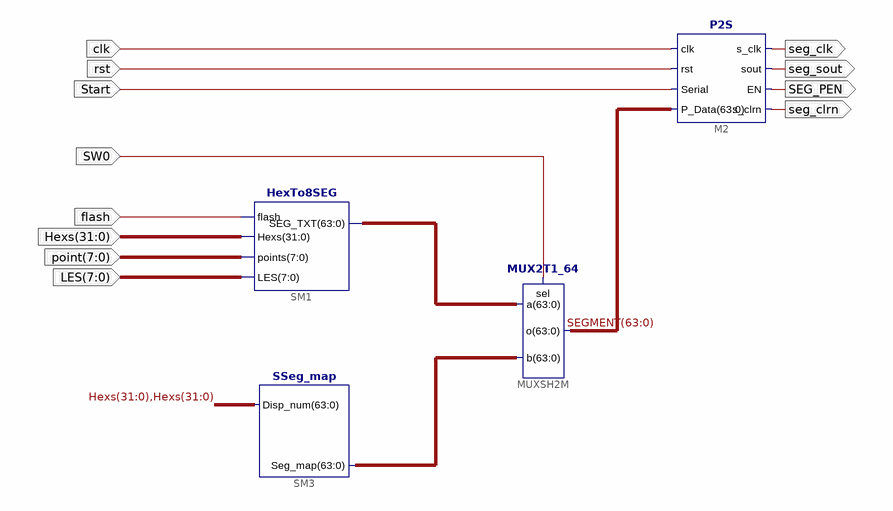
[diagram p0: schematic sheet 1]
// Xilinx ISE schematic SSeg7_Dev.sch (kintex7) as structural Verilog: 4 symbols, 12 ports
module SSeg7_Dev (
  input  clk,
  input  rst,
  input  Start,
  input  SW0,
  input  flash,
  input  [31:0] Hexs,
  input  [7:0] point,
  input  [7:0] LES,
  output seg_clk,
  output seg_sout,
  output SEG_PEN,
  output seg_clrn
);

  wire [63:0] SEGMENT, XLXN_22, XLXN_23;

  SSeg_map SM3 (.Disp_num({Hexs, Hexs}), .Seg_map(XLXN_23));
  MUX2T1_64 MUXSH2M (.b(XLXN_23), .sel(SW0), .a(XLXN_22), .o(SEGMENT));
  HexTo8SEG SM1 (.LES(LES), .points(point), .Hexs(Hexs), .SEG_TXT(XLXN_22), .flash(flash));
  P2S M2 (
    .s_clrn(seg_clrn), .sout(seg_sout), .rst(rst), .EN(SEG_PEN), .Serial(Start), .clk(clk), .s_clk(seg_clk),
    .P_Data(SEGMENT));
endmodule
